# Altium schematic sheet Sheet1.SchDoc
size A3; SheetNumber: 1; SheetTotal: 1
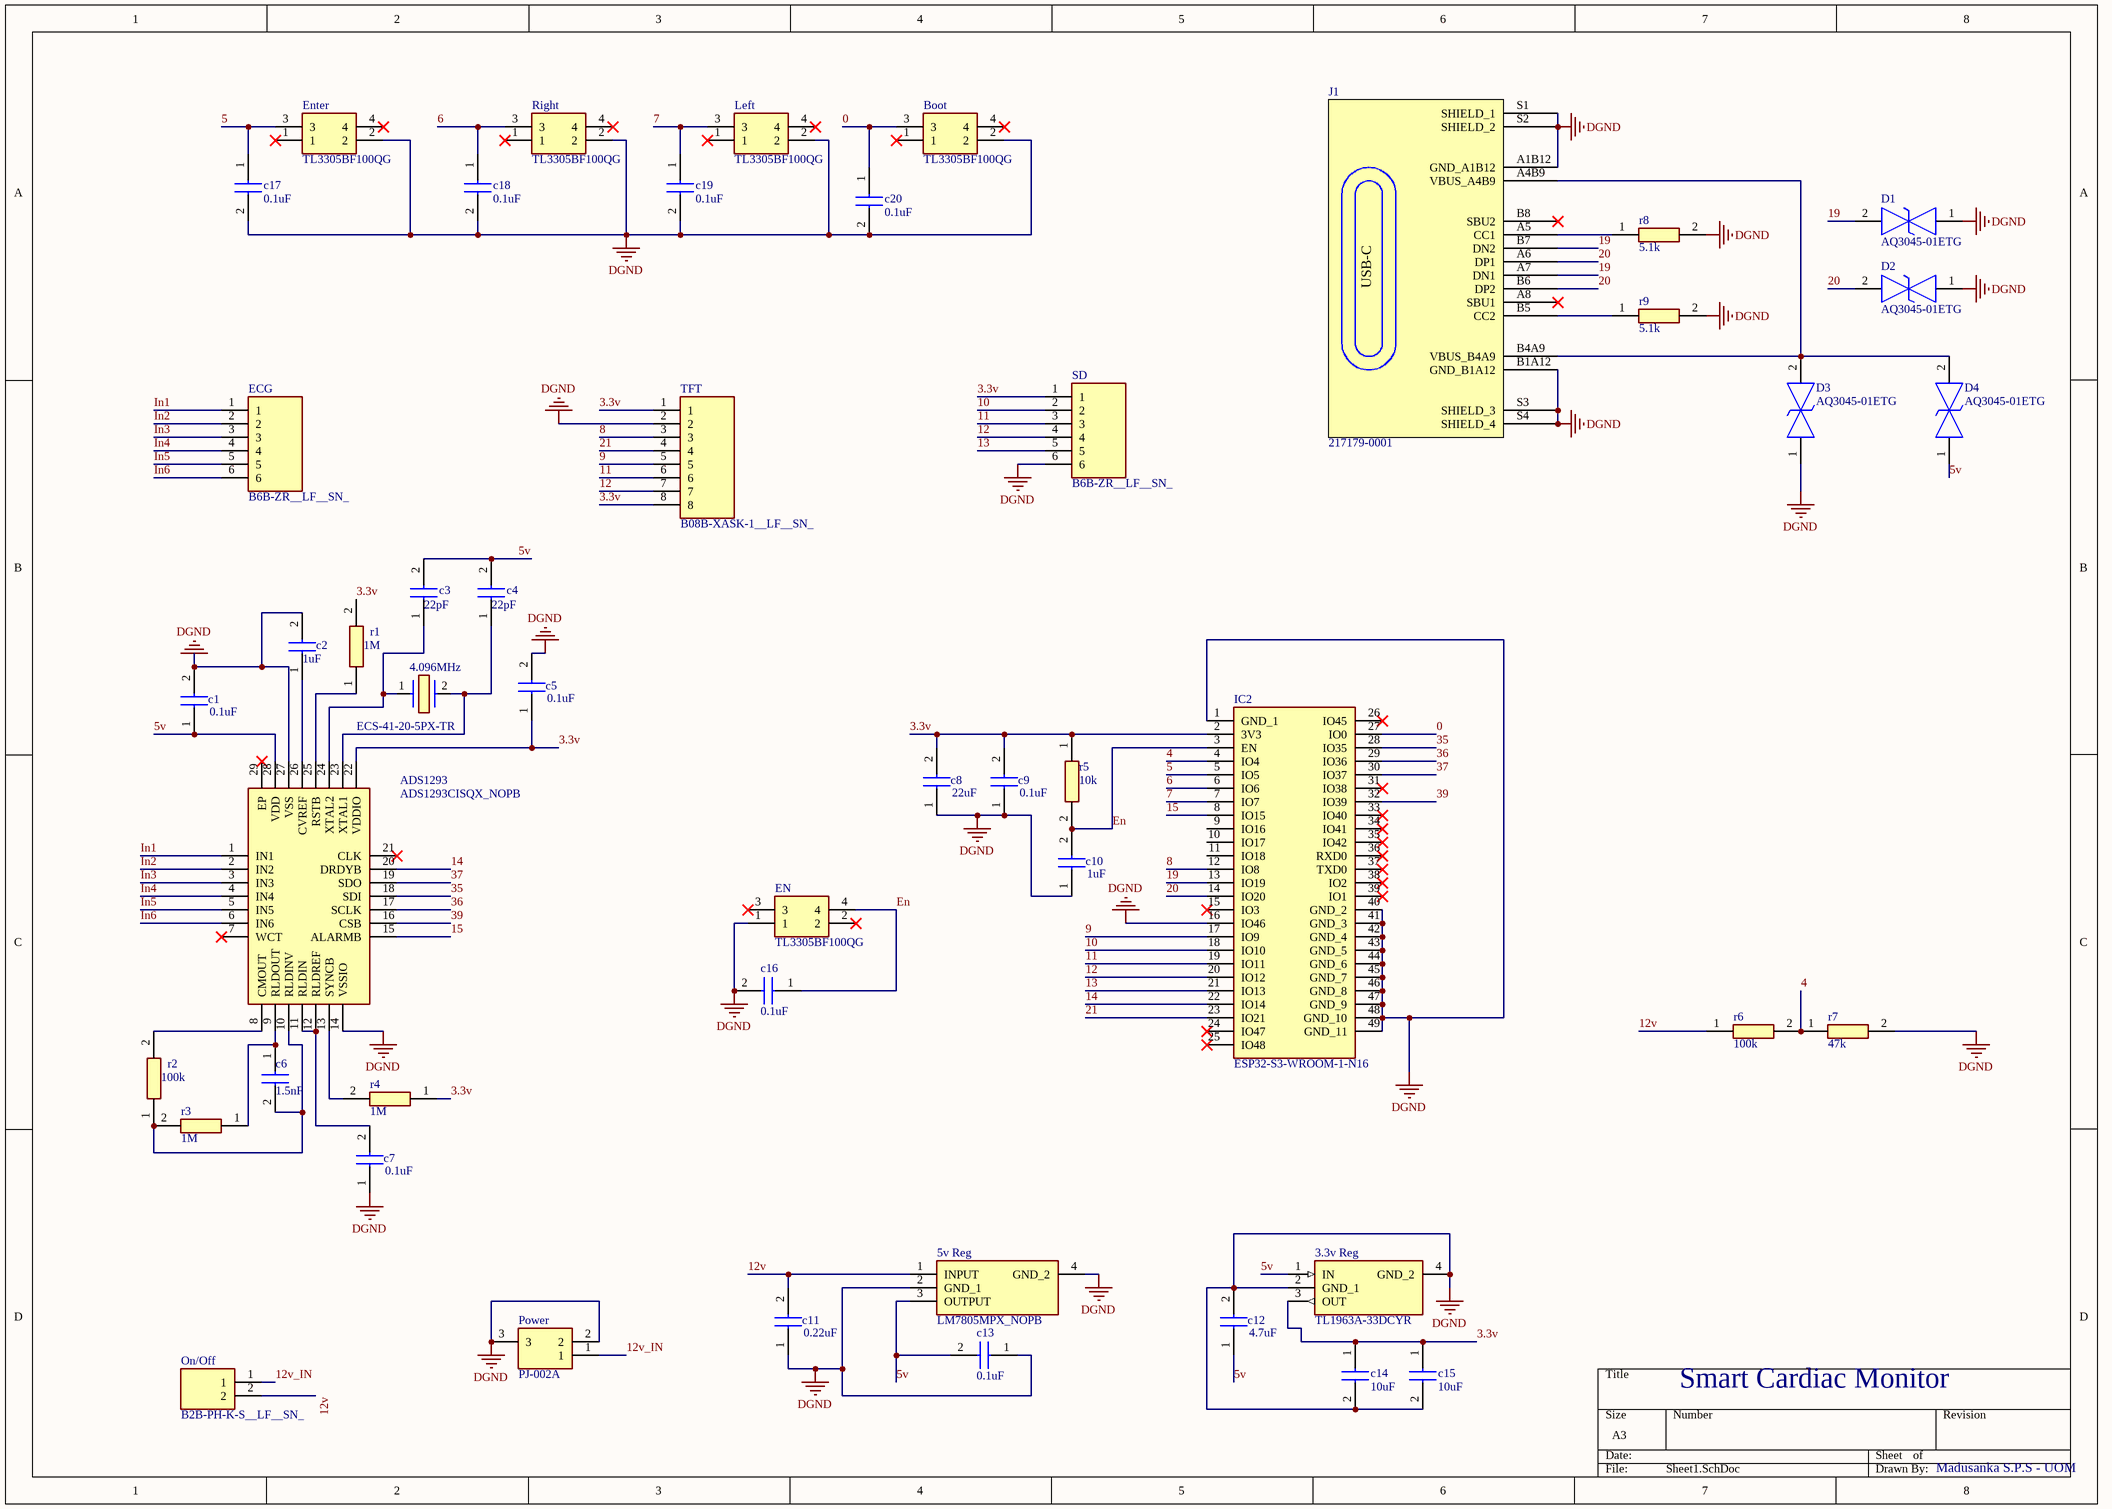
[diagram p0: Sheet1.SchDoc]

## Parts
3.3v_Reg  TL1963A-33DCYR  [SOT230P700X180-4N]
4.096MHz  ECS-41-20-5PX-TR  [ECS41205PXTR]
5v_Reg  LM7805MPX_NOPB  [SOT230P700X180-4N]
ADS1293  ADS1293CISQX_NOPB  [QFN50P500X500X80-29N]
Boot  TL3305BF100QG  [TL3305BF160QG]
c1  0.1uF  [CAPC2012X140N]
c2  1uF  [CAPC2012X140N]
c3  22pF  [CAPC2012X140N]
c4  22pF  [CAPC2012X140N]
c5  0.1uF  [CAPC2012X140N]
c6  1.5nF  [CAPC2012X140N]
c7  0.1uF  [CAPC2012X140N]
c8  22uF  [CAPC2012X140N]
c9  0.1uF  [CAPC2012X140N]
c10  1uF  [CAPC2012X140N]
c11  0.22uF  [CAPC2012X140N]
c12  4.7uF  [CAPC2012X140N]
c13  0.1uF  [CAPC2012X140N]
c14  10uF  [CAPC2012X140N]
c15  10uF  [CAPC2012X140N]
c16  0.1uF  [CAPC2012X140N]
c17  0.1uF  [CAPC2012X140N]
c18  0.1uF  [CAPC2012X140N]
c19  0.1uF  [CAPC2012X140N]
c20  0.1uF  [CAPC2012X140N]
D1  AQ3045-01ETG  [AQ304501ETG]
D2  AQ3045-01ETG  [AQ304501ETG]
D3  AQ3045-01ETG  [AQ304501ETG]
D4  AQ3045-01ETG  [AQ304501ETG]
ECG  B6B-ZR__LF__SN_  [SHDR6W50P0X150_1X6_1050X350X450P]
EN  TL3305BF100QG  [TL3305BF160QG]
Enter  TL3305BF100QG  [TL3305BF160QG]
IC2  ESP32-S3-WROOM-1-N16  [ESP32S3WROOM1N16]
J1  217179-0001  [FP-2171790001-MFG]
Left  TL3305BF100QG  [TL3305BF160QG]
On/Off  B2B-PH-K-S__LF__SN_  [B2BPHKSLFSN]
Power  PJ-002A  [PJ002A]
r1  1M  [ERJUP6]
r2  100k  [ERJUP6]
r3  1M  [ERJUP6]
r4  1M  [ERJUP6]
r5  10k  [ERJUP6]
r6  100k  [ERJUP6]
r7  47k  [ERJUP6]
r8  5.1k  [ERJUP6]
r9  5.1k  [ERJUP6]
Right  TL3305BF100QG  [TL3305BF160QG]
SD  B6B-ZR__LF__SN_  [SHDR6W50P0X150_1X6_1050X350X450P]
TFT  B08B-XASK-1__LF__SN_  [SHDR8W60P0X250_1X8_2250X640X880P]

## Nets
DGND: 3.3v_Reg.2(GND_1) 3.3v_Reg.4(GND_2) 5v_Reg.2(GND_1) 5v_Reg.4(GND_2) ADS1293.14(VSSIO) ADS1293.27(VSS) Boot.2 c1.2 c2.2 c5.2 c7.1 c8.1 c9.1 c10.1 c11.1 c12.2 c13.1 c14.2 c15.2 c16.2 c17.2 c18.2 c19.2 c20.2 D1.1 D2.1 D3.1 EN.1 Enter.2 IC2.1(GND_1) IC2.16(IO46) IC2.40(GND_2) IC2.41(GND_3) IC2.42(GND_4) IC2.43(GND_5) IC2.44(GND_6) IC2.45(GND_7) IC2.46(GND_8) IC2.47(GND_9) IC2.48(GND_10) IC2.49(GND_11) J1.A1B12(GND_A1B12) J1.B1A12(GND_B1A12) J1.S1(SHIELD_1) J1.S2(SHIELD_2) J1.S3(SHIELD_3) J1.S4(SHIELD_4) Left.2 Power.2 Power.3 r7.2 r8.2 r9.2 Right.2 SD.6 TFT.2
0: Boot.3 c20.1 IC2.27(IO0)
3.3v: 3.3v_Reg.3(OUT) ADS1293.22(VDDIO) c5.1 c8.2 c9.2 c14.1 c15.1 IC2.2(3V3) r1.2 r4.1 r5.1 SD.1 TFT.1 TFT.8
4: IC2.4(IO4) r6.2 r7.1
5: c17.1 Enter.3 IC2.5(IO5)
5v: 3.3v_Reg.1(IN) 5v_Reg.3(OUTPUT) ADS1293.28(VDD) c1.1 c3.2 c4.2 c12.1 c13.2 D4.1
6: c18.1 IC2.6(IO6) Right.3
7: c19.1 IC2.7(IO7) Left.3
8: IC2.12(IO8) TFT.3
9: IC2.17(IO9) TFT.5
10: IC2.18(IO10) SD.2
11: IC2.19(IO11) SD.3 TFT.6
12: IC2.20(IO12) SD.4 TFT.7
12v: 5v_Reg.1(INPUT) c11.2 On/Off.2 r6.1
12v_IN: On/Off.1 Power.1
13: IC2.21(IO13) SD.5
14: ADS1293.20(DRDYB) IC2.22(IO14)
15: ADS1293.15(ALARMB) IC2.8(IO15)
19: D1.2 IC2.13(IO19) J1.A7(DN1) J1.B7(DN2)
20: D2.2 IC2.14(IO20) J1.A6(DP1) J1.B6(DP2)
21: IC2.23(IO21) TFT.4
35: ADS1293.18(SDI) IC2.28(IO35)
36: ADS1293.17(SCLK) IC2.29(IO36)
37: ADS1293.19(SDO) IC2.30(IO37)
39: ADS1293.16(CSB) IC2.32(IO39)
En: c10.2 c16.1 EN.4 IC2.3(EN) r5.2
In1: ADS1293.1(IN1) ECG.1
In2: ADS1293.2(IN2) ECG.2
In3: ADS1293.3(IN3) ECG.3
In4: ADS1293.4(IN4) ECG.4
In5: ADS1293.5(IN5) ECG.5
In6: ADS1293.6(IN6) ECG.6
Net4.096MHz_1: 4.096MHz.1 ADS1293.24(XTAL2) c3.1
Net4.096MHz_2: 4.096MHz.2 ADS1293.23(XTAL1) c4.1
NetADS1293_8: ADS1293.8(CMOUT) r2.2
NetADS1293_9: ADS1293.9(RLDOUT) c6.1 r3.1
NetADS1293_10: ADS1293.10(RLDINV) c6.2 r2.1 r3.2
NetADS1293_11: ADS1293.11(RLDIN) ADS1293.12(RLDREF) c7.2
NetADS1293_13: ADS1293.13(SYNCB) r4.2
NetADS1293_25: ADS1293.25(RSTB) r1.1
NetADS1293_26: ADS1293.26(CVREF) c2.1
NetD3_2: D3.2 D4.2 J1.A4B9(VBUS_A4B9) J1.B4A9(VBUS_B4A9)
NetJ1_A5: J1.A5(CC1) r8.1
NetJ1_B5: J1.B5(CC2) r9.1

Not connected (* = marked no-connect by the designer): ADS1293 7(WCT)* 21(CLK)* 29(EP)*; Boot 1* 4*; EN 2* 3*; Enter 1* 4*; IC2 9(IO16) 10(IO17) 11(IO18) 15(IO3)* 24(IO47)* 25(IO48)* 26(IO45)* 31(IO38)* 33(IO40)* 34(IO41)* 35(IO42)* 36(RXD0)* 37(TXD0)* 38(IO2)* 39(IO1)*; J1 A8(SBU1)* B8(SBU2)*; Left 1* 4*; Right 1* 4*

## Notes on the sheet
- Smart Cardiac Monitor
- Madusanka S.P.S - UOM
- (in symbol 217179-0001) USB-C

## Library data of the parts
3.3v_Reg = TL1963A-33DCYR: Power Supply; Manufacturer_Name: Texas Instruments; Datasheet Link: http://www.ti.com/lit/gpn/tl1963a; Height: 1.8mm; Manufacturer_Part_Number: TL1963A-33DCYR; Mouser Part Number: 595-TL1963A-33DCYR; Mouser Price/Stock: https://www.mouser.co.uk/ProductDetail/Texas-Instruments/TL1963A-33DCYR?qs=IK5e5L0zOXhRu%2FNTAfJNEA%3D%3D; Arrow Part Number: TL1963A-33DCYR; Arrow Price/Stock: https://www.arrow.com/en/products/tl1963a-33dcyr/texas-instruments?utm_currency=USD&region=nac
4.096MHz = ECS-41-20-5PX-TR: Crystal or Oscillator; Manufacturer_Name: ECS; Datasheet Link: https://www.ecsxtal.com/store/pdf/csm-7x.pdf; Height: 4.3mm; Manufacturer_Part_Number: ECS-41-20-5PX-TR; Mouser Part Number: 520-CSM409-20-X; Mouser Price/Stock: https://www.mouser.co.uk/ProductDetail/ECS/ECS-41-20-5PX-TR?qs=CkbNAJEAr%2FSFHGf3GK%252BDrQ%3D%3D; Arrow Part Number: ECS-41-20-5PX-TR; Arrow Price/Stock: https://www.arrow.com/en/products/ecs-41-20-5px-tr/ecs-international
5v_Reg = LM7805MPX_NOPB: Integrated Circuit; Manufacturer_Name: Texas Instruments; Manufacturer_Part_Number: LM7805MPX/NOPB; Datasheet Link: https://www.arrow.com/en/products/lm7805mpxnopb/texas-instruments; Height: 1.8mm; Mouser Part Number: 595-LM7805MPX/NOPB; Mouser Price/Stock: https://www.mouser.co.uk/ProductDetail/Texas-Instruments/LM7805MPX-NOPB?qs=gO6GG99qvRCSwIVAoVKHPw%3D%3D; Arrow Part Number: LM7805MPX/NOPB; Arrow Price/Stock: https://www.arrow.com/en/products/lm7805mpxnopb/texas-instruments?region=nac
ADS1293 = ADS1293CISQX_NOPB: Integrated Circuit; Manufacturer_Name: Texas Instruments; Manufacturer_Part_Number: ADS1293CISQX/NOPB; Datasheet Link: https://www.arrow.com/en/products/ads1293cisqxnopb/texas-instruments?region=nac; Height: 0.8mm; Mouser Part Number: 595-ADS1293CISQXNPB; Mouser Price/Stock: https://www.mouser.co.uk/ProductDetail/Texas-Instruments/ADS1293CISQX-NOPB?qs=T1E5mKGHTGVRqLM5czdGYQ%3D%3D; Arrow Part Number: ADS1293CISQX/NOPB; Arrow Price/Stock: https://www.arrow.com/en/products/ads1293cisqxnopb/texas-instruments?region=nac
Boot EN Enter Left Right = TL3305BF100QG: Switch; Manufacturer_Name: E-Switch; Datasheet Link: https://configured-product-images.s3.amazonaws.com/2D/specs/TL3305BF100QG.pdf; Manufacturer_Part_Number: TL3305BF100QG; Mouser Part Number: 612-TL3305BF100QG; Mouser Price/Stock: https://www.mouser.co.uk/ProductDetail/E-Switch/TL3305BF100QG?qs=IKkN%2F947nfDIPwqPQja%252BvQ%3D%3D
c1-c20 = 0805_1: Capacitor; Manufacturer_Name: KEMET; Manufacturer_Part_Number: C0805C274K1RACTU; Datasheet Link: https://search.kemet.com/component-documentation/download/specsheet/C0805C274K1RACTU; Height: 1.4mm; Mouser Part Number: 80-C0805C274K1RACTU; Mouser Price/Stock: https://www.mouser.co.uk/ProductDetail/KEMET/C0805C274K1RACTU?qs=wT7LY0lnAe2hDy7V5z73eA%3D%3D
D1-D4 = AQ3045-01ETG: TVS Diode (Bi-directional); Manufacturer_Name: LITTELFUSE; Datasheet Link: http://m.littelfuse.com/~/media/electronics/datasheets/tvs_diode_arrays/littelfuse_tvs_diode_array_aq3045_datasheet.pdf.pdf; Height: 0.42mm; Manufacturer_Part_Number: AQ3045-01ETG; Mouser Part Number: 576-AQ3045-01ETG; Mouser Price/Stock: https://www.mouser.co.uk/ProductDetail/Littelfuse/AQ3045-01ETG?qs=lM4gFlnEeEMEfe%252B5jSw4OA%3D%3D; Arrow Part Number: AQ3045-01ETG; Arrow Price/Stock: https://www.arrow.com/en/products/aq3045-01etg/littelfuse?region=nac
ECG SD = B6B-ZR__LF__SN_: Connector; Manufacturer_Name: JST (JAPAN SOLDERLESS TERMINALS); Manufacturer_Part_Number: B6B-ZR (LF)(SN); Height: 4.5mm
IC2 = ESP32-S3-WROOM-1-N16: Integrated Circuit; Manufacturer_Name: Espressif Systems; Datasheet Link: https://www.espressif.com/sites/default/files/documentation/esp32-s3-wroom-1_wroom-1u_datasheet_en.pdf; Height: 3.25mm; Manufacturer_Part_Number: ESP32-S3-WROOM-1-N16; Mouser Part Number: 356-ESP32S3WROOM1N16; Mouser Price/Stock: https://www.mouser.co.uk/ProductDetail/Espressif-Systems/ESP32-S3-WROOM-1-N16?qs=Li%252BoUPsLEntjPrtJwwS5Pw%3D%3D
J1 = 217179-0001: CONN RCP USB2.0 TYP C 24P SMD RA; Manufacturer: Molex; Supplier: Digikey; Supplier Part Number: 900-2171790001CT-ND; Manufacturer Part Number: 217179-0001; RoHS: No; Category: Connectors; Stock: 7013; Pricing: 1=0,79, 10=0,645, 25=0,5948, 50=0,5594, 100=0,5259, 250=0,48484, 500=0,45592 (USD); LCSC Part Number: C3197684
On/Off = B2B-PH-K-S__LF__SN_: Circulator or Directional Coupler; Manufacturer_Name: JST (JAPAN SOLDERLESS TERMINALS); Manufacturer_Part_Number: B2B-PH-K-S (LF)(SN); Datasheet Link: http://www.jst-mfg.com/product/pdf/eng/ePH.pdf; Height: 6mm
Power = PJ-002A: Integrated Circuit; Manufacturer_Name: Same Sky; Datasheet Link: https://www.sameskydevices.com/product/resource/supplyframepdf/pj-002a.pdf; Height: 11mm; Manufacturer_Part_Number: PJ-002A; Mouser Part Number: 490-PJ-002A; Mouser Price/Stock: https://www.mouser.co.uk/ProductDetail/CUI-Devices/PJ-002A?qs=WyjlAZoYn51CKfAix9Mngw%3D%3D; Arrow Part Number: PJ-002A; Arrow Price/Stock: https://www.arrow.com/en/products/pj-002a/cui-devices?utm_currency=USD&region=europe
r1-r9 = 0805: Resistor; Manufacturer_Name: Panasonic; Manufacturer_Part_Number: ERJ-UP6D36R0V; Datasheet Link: https://industrial.panasonic.com/cdbs/www-data/pdf/RDP0000/AOA0000C337.pdf; Height: 0.7mm; Mouser Part Number: 667-ERJ-UP6D36R0V; Mouser Price/Stock: https://www.mouser.co.uk/ProductDetail/Panasonic/ERJ-UP6D36R0V?qs=ZcfC38r4PouQYziqW4pNbg%3D%3D
TFT = B08B-XASK-1__LF__SN_: Connector; Manufacturer_Name: JST (JAPAN SOLDERLESS TERMINALS); Manufacturer_Part_Number: B08B-XASK-1 (LF)(SN); Datasheet Link: http://uk.rs-online.com/web/p/products/1667521; Height: 8.8mm